# Altium project POEInjector.PrjPcb
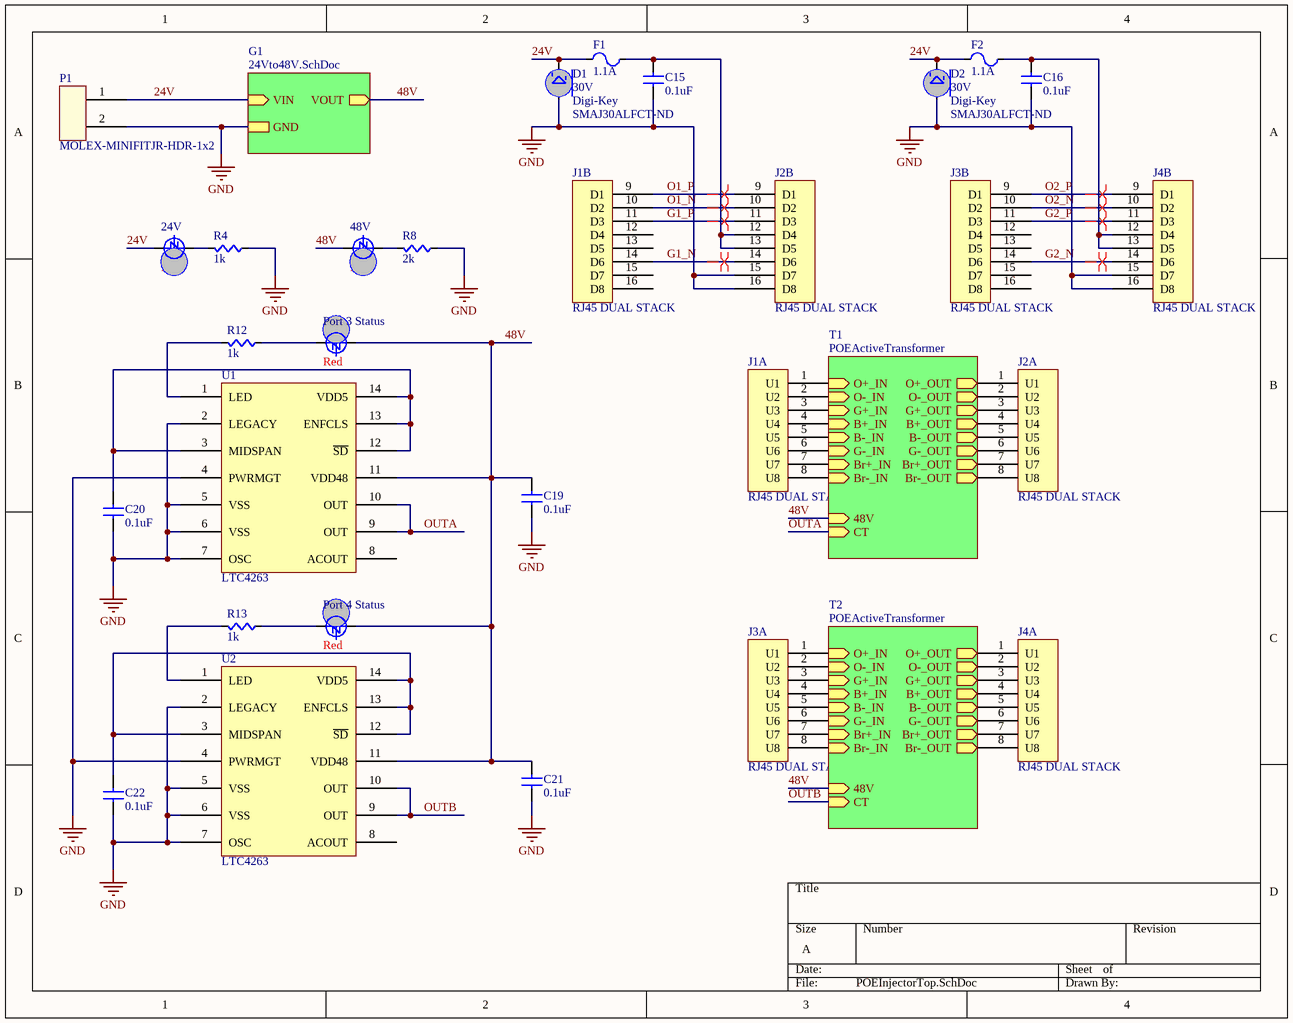
[diagram p0: POEInjectorTop.SchDoc]
3 sheets, 59 parts. Net scope: hierarchical (ports join the sheet entries above them; power ports are global).
Board file: POEInjector.PcbDoc
Sheets:
  POEInjectorTop.SchDoc
    G1 = 24Vto48V.SchDoc
    T1 = POEActiveTransformer.SchDoc
    T2 = POEActiveTransformer.SchDoc

## Sheet POEInjectorTop.SchDoc
size A

### Parts
24V  Color: Red  [LED0603]  (hidden comment: LED)
48V  Color: Red  [LED0603]  (hidden comment: LED)
C15  value 0.1uF  [CAPC0603]  (hidden comment: Cap)
C16  value 0.1uF  [CAPC0603]  (hidden comment: Cap)
C19  value 0.1uF  [CAPC0603]  (hidden comment: Cap)
C20  value 0.1uF  [CAPC0603]  (hidden comment: Cap)
C21  value 0.1uF  [CAPC0603]  (hidden comment: Cap)
C22  value 0.1uF  [CAPC0603]  (hidden comment: Cap)
D1  value 30V  Supplier 1: Digi-Key  Supplier Part Number 1: SMAJ30ALFCT-ND  [SMASeries]  (hidden comment: Zener)
D2  value 30V  Supplier 1: Digi-Key  Supplier Part Number 1: SMAJ30ALFCT-ND  [SMASeries]  (hidden comment: Zener)
F1  value 1.1A  [PTC7451X11N]  (hidden comment: PTC Fuse)
F2  value 1.1A  [PTC7451X11N]  (hidden comment: PTC Fuse)
J1  RJ45 DUAL STACK  [RJ45 DUAL STACK]  (parts A,B of 2)
J2  RJ45 DUAL STACK  [RJ45 DUAL STACK]  (parts A,B of 2)
J3  RJ45 DUAL STACK  [RJ45 DUAL STACK]  (parts A,B of 2)
J4  RJ45 DUAL STACK  [RJ45 DUAL STACK]  (parts A,B of 2)
P1  MOLEX-MINIFITJR-HDR-1x2  [MOLEX-MINIFITJR-HDR-1x2]
Port_3_Status  Color: Red  [LED0603]  (hidden comment: LED)
Port_4_Status  Color: Red  [LED0603]  (hidden comment: LED)
R4  value 1k  [RES0603]  (hidden comment: Res)
R8  value 2k  [RES0603]  (hidden comment: Res)
R12  value 1k  [RES0603]  (hidden comment: Res)
R13  value 1k  [RES0603]  (hidden comment: Res)
U1  LTC4263  [LTC4263]
U2  LTC4263  [LTC4263]

### Sub-sheets
G1 = 24Vto48V.SchDoc: VIN (in), GND, VOUT (out)
T1 = POEActiveTransformer: O+_IN, O-_IN, G+_IN, B+_IN, B-_IN, G-_IN, Br+_IN, Br-_IN, O+_OUT, O-_OUT, G+_OUT, B+_OUT, B-_OUT, G-_OUT, Br+_OUT, Br-_OUT, 48V, CT
T2 = POEActiveTransformer: O+_IN, O-_IN, G+_IN, B+_IN, B-_IN, G-_IN, Br+_IN, Br-_IN, O+_OUT, O-_OUT, G+_OUT, B+_OUT, B-_OUT, G-_OUT, Br+_OUT, Br-_OUT, 48V, CT

### Nets
GND: C15.2(B) C16.2(B) C19.2(B) C20.2(B) C21.2(B) C22.2(B) D1.A D2.A J2.15(D7) J2.16(D8) J4.15(D7) J4.16(D8) P1.2 R4.2(B) R8.2(B) U1.2(LEGACY) U1.4(PWRMGT) U1.5(VSS) U1.6(VSS) U1.7(OSC) U2.2(LEGACY) U2.4(PWRMGT) U2.5(VSS) U2.6(VSS) U2.7(OSC) ; sheet G1/GND
24V: 24V.A D1.C D2.C F1.1(A) F2.1(A) P1.1 ; sheet G1/VIN
48V: 48V.A C19.1(A) C21.1(A) Port_3_Status.A Port_4_Status.A U1.11(VDD48) U2.11(VDD48) ; sheet G1/VOUT, sheet T1/48V, sheet T2/48V
B_IN_N: J1.5(U5) ; sheet T1/B-_IN
B_IN_N: J3.5(U5) ; sheet T2/B-_IN  [a separate net that carries the same name]
B_IN_P: J1.4(U4) ; sheet T1/B+_IN
B_IN_P: J3.4(U4) ; sheet T2/B+_IN  [a separate net that carries the same name]
B_OUT_N: J2.5(U5) ; sheet T1/B-_OUT
B_OUT_N: J4.5(U5) ; sheet T2/B-_OUT  [a separate net that carries the same name]
B_OUT_P: J2.4(U4) ; sheet T1/B+_OUT
B_OUT_P: J4.4(U4) ; sheet T2/B+_OUT  [a separate net that carries the same name]
Br_IN_N: J1.8(U8) ; sheet T1/Br-_IN
Br_IN_N: J3.8(U8) ; sheet T2/Br-_IN  [a separate net that carries the same name]
Br_IN_P: J1.7(U7) ; sheet T1/Br+_IN
Br_IN_P: J3.7(U7) ; sheet T2/Br+_IN  [a separate net that carries the same name]
Br_OUT_N: J2.8(U8) ; sheet T1/Br-_OUT
Br_OUT_N: J4.8(U8) ; sheet T2/Br-_OUT  [a separate net that carries the same name]
Br_OUT_P: J2.7(U7) ; sheet T1/Br+_OUT
Br_OUT_P: J4.7(U7) ; sheet T2/Br+_OUT  [a separate net that carries the same name]
G1_N: J1.14(D6) J2.14(D6)
G1_P: J1.11(D3) J2.11(D3)
G2_N: J3.14(D6) J4.14(D6)
G2_P: J3.11(D3) J4.11(D3)
G_IN_N: J1.6(U6) ; sheet T1/G-_IN
G_IN_N: J3.6(U6) ; sheet T2/G-_IN  [a separate net that carries the same name]
G_IN_P: J1.3(U3) ; sheet T1/G+_IN
G_IN_P: J3.3(U3) ; sheet T2/G+_IN  [a separate net that carries the same name]
G_OUT_N: J2.6(U6) ; sheet T1/G-_OUT
G_OUT_N: J4.6(U6) ; sheet T2/G-_OUT  [a separate net that carries the same name]
G_OUT_P: J2.3(U3) ; sheet T1/G+_OUT
G_OUT_P: J4.3(U3) ; sheet T2/G+_OUT  [a separate net that carries the same name]
O1_N: J1.10(D2) J2.10(D2)
O1_P: J1.9(D1) J2.9(D1)
O2_N: J3.10(D2) J4.10(D2)
O2_P: J3.9(D1) J4.9(D1)
O_IN_N: J1.2(U2) ; sheet T1/O-_IN
O_IN_N: J3.2(U2) ; sheet T2/O-_IN  [a separate net that carries the same name]
O_IN_P: J1.1(U1) ; sheet T1/O+_IN
O_IN_P: J3.1(U1) ; sheet T2/O+_IN  [a separate net that carries the same name]
O_OUT_N: J2.2(U2) ; sheet T1/O-_OUT
O_OUT_N: J4.2(U2) ; sheet T2/O-_OUT  [a separate net that carries the same name]
O_OUT_P: J2.1(U1) ; sheet T1/O+_OUT
O_OUT_P: J4.1(U1) ; sheet T2/O+_OUT  [a separate net that carries the same name]
OUTA: U1.9(OUT) U1.10(OUT) ; sheet T1/CT
OUTB: U2.9(OUT) U2.10(OUT) ; sheet T2/CT  [project net OUTA]
Net24V_C: 24V.C R4.1(A)
Net48V_C: 48V.C R8.1(A)
NetC15_1: C15.1(A) F1.2(B) J2.12(D4) J2.13(D5)
NetC16_1: C16.1(A) F2.2(B) J4.12(D4) J4.13(D5)
NetC20_1: C20.1(A) U1.3(MIDSPAN) U1.12(~{SD}) U1.13(ENFCLS) U1.14(VDD5)
NetC22_1: C22.1(A) U2.3(MIDSPAN) U2.12(~{SD}) U2.13(ENFCLS) U2.14(VDD5)
NetPort_3_Status_C: Port_3_Status.C R12.2(B)
NetPort_4_Status_C: Port_4_Status.C R13.2(B)
NetR12_1: R12.1(A) U1.1(LED)
NetR13_1: R13.1(A) U2.1(LED)

Not connected (* = marked no-connect by the designer): J1 12(D4) 13(D5) 15(D7) 16(D8); J3 12(D4) 13(D5) 15(D7) 16(D8); U1 8(ACOUT); U2 8(ACOUT)

### Layout directives
differential pair: G1_N, G1_P, G2_N, G2_P, O1_N, O1_P, O2_N, O2_P

### Library data of the parts
D1 D2 = Zener: Zener Diode
F1 F2 = PTC_Fuse: Supplier 1: Digi-Key; Supplier Part Number 1: 507-1744-1-ND
J1-J4 = RJ45 DUAL STACK: CONN MOD JACK 8P8C R/A SHIELDED; Supplier 1: Digi-Key; Supplier Part Number 1: A31482-ND
P1 = MOLEX-MINIFITJR-HDR-1x2: MINIFITJRHDR VT DR O/PGS 2POS; Supplier 1: Digi-Key; Supplier Part Number 1: WM9814-ND
U1 U2 = LTC4263: IC POE 803.2AF SINGL PSE 14-SOIC; Supplier 1: Digi-Key; Supplier Part Number 1: LTC4263CS#PBF-ND
24V 48V Port_3_Status Port_4_Status = LED: Supplier 1: Digi-Key; Supplier Part Number 1: 754-1122-1-ND
C15 C16 C19-C22 = Cap: Supplier 1: Digi-Key
  C15 C16 C19 C21: Supplier Part Number 1: 1276-6807-1-ND
  C20 C22: Supplier Part Number 1: 1276-1000-1-ND
R4 R8 R12 R13 = Res: Supplier 1: Digi-Key
  R4 R12 R13: Supplier Part Number 1: RMCF0603JJ1K00CT-ND
  R8: Supplier Part Number 1: RMCF0603JT2K00CT-ND

## Sheet 24Vto48V.SchDoc
size A
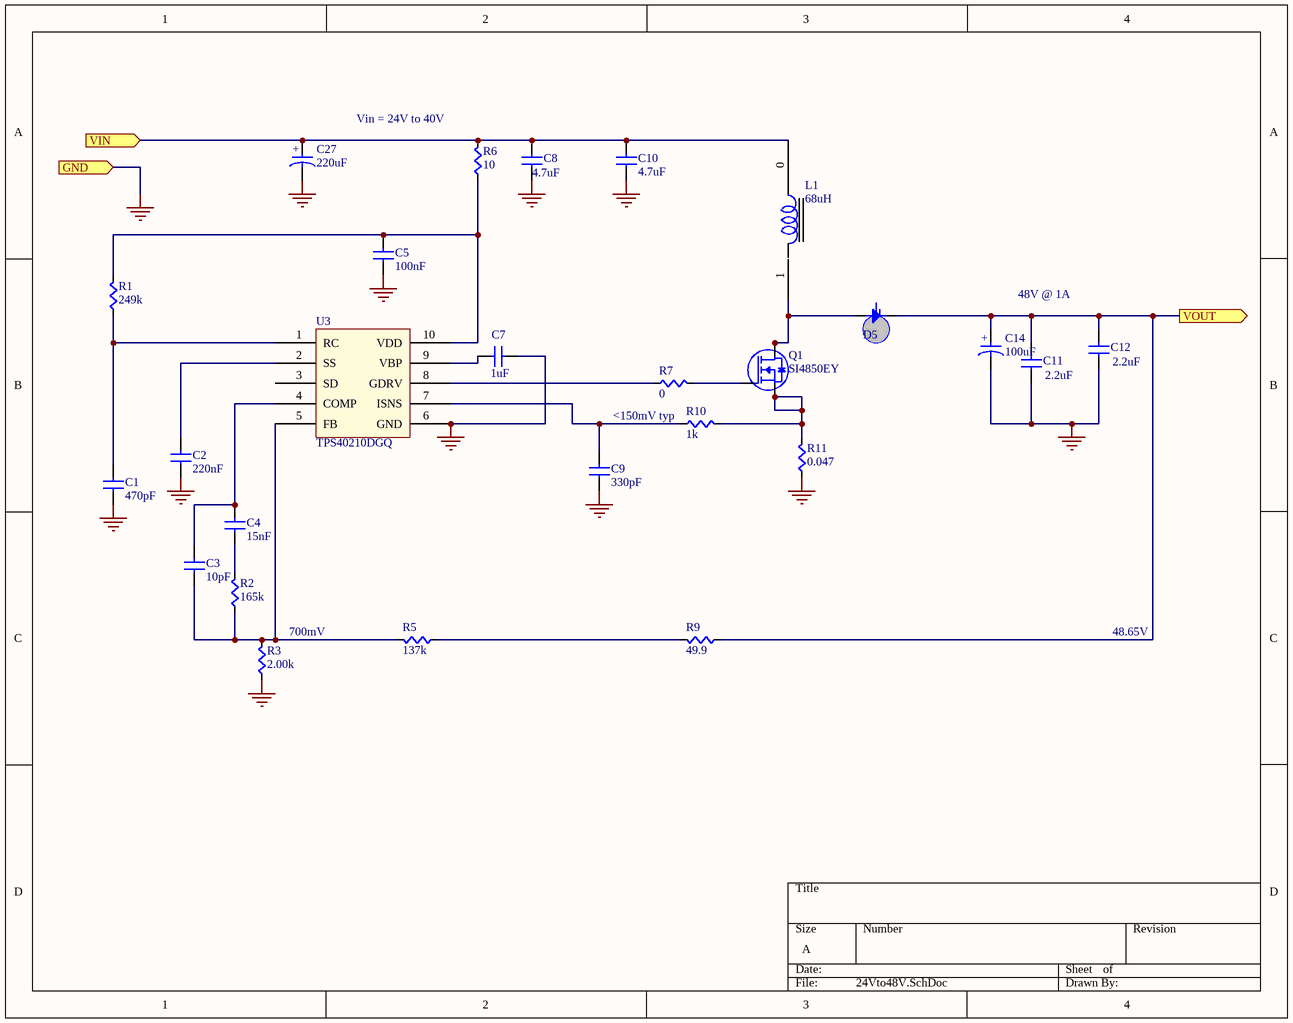
[diagram p1: 24Vto48V.SchDoc]

### Parts
C1  value 470pF  [CAPC0603]  (hidden comment: Cap)
C2  value 220nF  [CAPC0603]  (hidden comment: Cap)
C3  value 10pF  [CAPC0603]  (hidden comment: Cap)
C4  value 15nF  [CAPC0603]  (hidden comment: Cap)
C5  value 100nF  [CAPC0603]  (hidden comment: Cap)
C7  value 1uF  [CAPC0603]  (hidden comment: Cap)
C8  value 4.7uF  [CAP1210]  (hidden comment: CAP1210)
C9  value 330pF  [CAPC0603]  (hidden comment: Cap)
C10  value 4.7uF  [CAP1210]  (hidden comment: CAP1210)
C11  value 2.2uF  [CAP1210]  (hidden comment: CAP1210)
C12  value 2.2uF  [CAP1210]  (hidden comment: CAP1210)
C14  value 100uF  [565-1720-ND]  (hidden comment: Cap Tant)
C27  value 220uF  [ESY227M050AH2AA]  (hidden comment: Cap Tant)
D5  Diode  [MBRS360SMB]  (value not drawn)
L1  value 68uH  [732-1247-1-ND]  (hidden comment: 37392C)
Q1  SI4850EY  [SOIC-8-NO-EP]
R1  value 249k  [RES0603]  (hidden comment: Res)
R2  value 165k  [RES0603]  (hidden comment: Res)
R3  value 2.00k  [RES0603]  (hidden comment: Res)
R5  value 137k  [RES0603]  (hidden comment: Res)
R6  value 10  [RES0603]  (hidden comment: Res)
R7  value 0  [RES0603]  (hidden comment: Res)
R9  value 49.9  [RES0603]  (hidden comment: Res)
R10  value 1k  [RES0603]  (hidden comment: Res)
R11  value 0.047  [RES2512]  (hidden comment: Res)
U3  TPS40210DGQ  [TPS40210]

### Ports
GND (in), VIN (in), VOUT (out)

### Nets
GND: C1.2(B) C2.2(B) C5.2(B) C7.2(B) C8.2(B) C9.2(B) C10.2(B) C11.2(B) C12.2(B) C14.2(B) C27.2(B) R3.2(B) R11.2(B) U3.6(GND) ; port GND
24V: C8.1(A) C10.1(A) C27.1(A) L1.0 R6.1(A) ; port VIN
48V: C11.1(A) C12.1(A) C14.1(A) D5.C R9.2(B) ; port VOUT
NetC1_1: C1.1(A) R1.2(B) U3.1(RC)
NetC2_1: C2.1(A) U3.2(SS)
NetC3_1: C3.1(A) C4.1(A) U3.4(COMP)
NetC3_2: C3.2(B) R2.2(B) R3.1(A) R5.1(A) U3.5(FB)
NetC4_2: C4.2(B) R2.1(A)
NetC5_1: C5.1(A) R1.1(A) R6.2(B) U3.10(VDD)
NetC7_1: C7.1(A) U3.9(VBP)
NetC9_1: C9.1(A) R10.2(B) U3.7(ISNS)
NetD5_A: D5.A L1.1 Q1.5(D) Q1.6(D) Q1.7(D) Q1.8(D)
NetQ1_1: Q1.1(S) Q1.2(S) Q1.3(S) R10.1(A) R11.1(A)
NetQ1_4: Q1.4(G) R7.1(A)
NetR5_2: R5.2(B) R9.1(A)
NetR7_2: R7.2(B) U3.8(GDRV)

Not connected (* = marked no-connect by the designer): U3 3(SD)

### Notes on the sheet
- (near R6) Vin = 24V to 40V
- 48V @ 1A
- (near R10) <150mV typ
- (near R3) 700mV
- 48.65V
- (in symbol CapPol) +

### Library data of the parts
C8 C10-C12 = CAP1210: CAP CER 10UF 50V 20% X5R 1210; Supplier 1: Digi-Key
  C8 C10: Supplier Part Number 1: 1276-1292-1-ND
  C11 C12: Supplier Part Number 1: 445-4498-1-ND
C14 = CapPol: 100 uF CAP ALUM 20% 63V RADIAL; Supplier 1: Digi-Key; Supplier Part Number 1: 493-12928-1-ND
C27 = CapPol: CAP ALUM 220UF; Supplier 1: Digi-Key; Supplier Part Number 1: 399-6123-ND
D5 = Diode: Standard Diode Template; Value: 60V 3A; Supplier Part Number 1: MBRS360BT3GOSCT-ND; Supplier: Digi-Key
L1 = 37392C: INDUCTOR 3.90UH 10.0A SMD; Supplier 1: Digi-Key; Supplier Part Number 1: 732-1247-1-ND
Q1 = SI4850EY: MOSFET N-CH 60V 6A 8-SOIC; Supplier 1: Digi-Key; Supplier Part Number 1: SI4850EY-T1-E3CT-ND
C1-C5 C7 C9 = Cap: Supplier 1: Digi-Key
  C1: Supplier Part Number 1: 399-7919-1-ND
  C2: Supplier Part Number 1: 445-1318-1-ND
  C3: Supplier Part Number 1: 490-3570-1-ND
  C4: Supplier Part Number 1: 1276-1967-1-ND
  C5: Supplier Part Number 1: 311-1343-1-ND
  C7: Supplier Part Number 1: 311-1446-1-ND
  C9: Supplier Part Number 1: 1276-6658-1-ND
R1-R3 R5-R7 R9-R11 = Res: Supplier 1: Digi-Key
  R1: Supplier Part Number 1: A102243CT-ND
  R2: Supplier Part Number 1: 311-165KHRCT-ND
  R3: Supplier Part Number 1: 311-2.00KHRCT-ND
  R5: Supplier Part Number 1: 311-137KHRCT-ND
  R6: Supplier Part Number 1: 311-10.0HRCT-ND
  R7: Supplier Part Number 1: 311-0.0GRCT-ND
  R9: Supplier Part Number 1: A102283CT-ND
  R10: Supplier Part Number 1: A102226CT-ND
  R11: Supplier Part Number 1: P47TCT-ND
U3 = TPS40210DGQ: Supplier Part Number 1: 296-26969-1-ND; Supplier 1: Digi-Key

## Sheet POEActiveTransformer.SchDoc
size A
Used 2 times, as channels T1, T2. Parts and nets are listed once, with the designators drawn on the sheet.
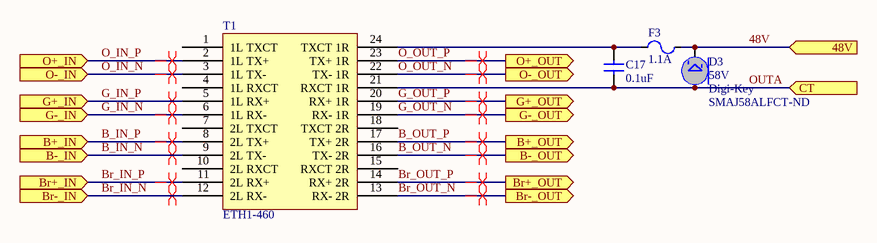
[diagram p2: POEActiveTransformer.SchDoc]

### Parts
C17  value 0.1uF  [CAPC0603]  (hidden comment: Cap)
D3  value 58V  Supplier 1: Digi-Key  Supplier Part Number 1: SMAJ58ALFCT-ND  [SMASeries]  (hidden comment: Zener)
F3  value 1.1A  [PTC7451X11N]  (hidden comment: PTC Fuse)
T1  ETH1-460  [ETH1-460]

### Ports
48V (in), B+_IN (in), B+_OUT (out), B-_IN (in), B-_OUT (out), Br+_IN (in), Br+_OUT (out), Br-_IN (in), Br-_OUT (out), CT (in), G+_IN (in), G+_OUT (out), G-_IN (in), G-_OUT (out), O+_IN (in), O+_OUT (out), O-_IN (in), O-_OUT (out)

### Nets
48V: D3.C F3.2(B) ; port 48V
B_IN_N: T1.9(2L_TX-) ; port B-_IN
B_IN_P: T1.8(2L_TX+) ; port B+_IN
B_OUT_N: T1.16(TX-_2R) ; port B-_OUT
B_OUT_P: T1.17(TX+_2R) ; port B+_OUT
Br_IN_N: T1.12(2L_RX-) ; port Br-_IN
Br_IN_P: T1.11(2L_RX+) ; port Br+_IN
Br_OUT_N: T1.13(RX-_2R) ; port Br-_OUT
Br_OUT_P: T1.14(RX+_2R) ; port Br+_OUT
G_IN_N: T1.6(1L_RX-) ; port G-_IN
G_IN_P: T1.5(1L_RX+) ; port G+_IN
G_OUT_N: T1.19(RX-_1R) ; port G-_OUT
G_OUT_P: T1.20(RX+_1R) ; port G+_OUT
O_IN_N: T1.3(1L_TX-) ; port O-_IN
O_IN_P: T1.2(1L_TX+) ; port O+_IN
O_OUT_N: T1.22(TX-_1R) ; port O-_OUT
O_OUT_P: T1.23(TX+_1R) ; port O+_OUT
OUTA: C17.2(B) D3.A T1.21(RXCT_1R) ; port CT
NetC17_1: C17.1(A) F3.1(A) T1.24(TXCT_1R)

Not connected (* = marked no-connect by the designer): T1 1(1L_TXCT) 4(1L_RXCT) 7(2L_TXCT) 10(2L_RXCT) 15(RXCT_2R) 18(TXCT_2R)

### Channels
T1: designators end in _T1; ports 48V=48V B+_IN=B_IN_P B+_OUT=B_OUT_P B-_IN=B_IN_N B-_OUT=B_OUT_N Br+_IN=Br_IN_P Br+_OUT=Br_OUT_P Br-_IN=Br_IN_N Br-_OUT=Br_OUT_N CT=OUTA G+_IN=G_IN_P G+_OUT=G_OUT_P G-_IN=G_IN_N G-_OUT=G_OUT_N O+_IN=O_IN_P O+_OUT=O_OUT_P O-_IN=O_IN_N O-_OUT=O_OUT_N
T2: designators end in _T2; ports 48V=48V B+_IN=B_IN_P B+_OUT=B_OUT_P B-_IN=B_IN_N B-_OUT=B_OUT_N Br+_IN=Br_IN_P Br+_OUT=Br_OUT_P Br-_IN=Br_IN_N Br-_OUT=Br_OUT_N CT=OUTA G+_IN=G_IN_P G+_OUT=G_OUT_P G-_IN=G_IN_N G-_OUT=G_OUT_N O+_IN=O_IN_P O+_OUT=O_OUT_P O-_IN=O_IN_N O-_OUT=O_OUT_N

### Layout directives
differential pair: B_IN_N, B_IN_P, B_OUT_N, B_OUT_P, Br_IN_N, Br_IN_P, Br_OUT_N, Br_OUT_P, G_IN_N, G_IN_P, G_OUT_N, G_OUT_P, O_IN_N, O_IN_P, O_OUT_N, O_OUT_P

### Library data of the parts
D3 = Zener: Zener Diode
F3 = PTC_Fuse: Supplier 1: Digi-Key; Supplier Part Number 1: 507-1744-1-ND
T1 = ETH1-460: "PoE Plus" Transformers Audio & Signal ETH1 60W 4pairs PoE+ Magnetic Module; Supplier 1: *; Supplier Part Number 1: *
C17 = Cap: Supplier 1: Digi-Key; Supplier Part Number 1: 1276-6807-1-ND

## Nets that join several sheets
GND: POEInjectorTop (25 pins), 24Vto48V (14 pins)
24V: POEInjectorTop (6 pins), 24Vto48V (5 pins)
48V: POEInjectorTop (7 pins), 24Vto48V (5 pins), T1 (D3_T1.C F3_T1.2), T2 (D3_T2.C F3_T2.2)
B_IN_N: POEInjectorTop (J1.5), T1 (T1_T1.9)
B_IN_N: POEInjectorTop (J3.5), T2 (T1_T2.9)
B_IN_P: POEInjectorTop (J1.4), T1 (T1_T1.8)
B_IN_P: POEInjectorTop (J3.4), T2 (T1_T2.8)
B_OUT_N: POEInjectorTop (J2.5), T1 (T1_T1.16)
B_OUT_N: POEInjectorTop (J4.5), T2 (T1_T2.16)
B_OUT_P: POEInjectorTop (J2.4), T1 (T1_T1.17)
B_OUT_P: POEInjectorTop (J4.4), T2 (T1_T2.17)
Br_IN_N: POEInjectorTop (J1.8), T1 (T1_T1.12)
Br_IN_N: POEInjectorTop (J3.8), T2 (T1_T2.12)
Br_IN_P: POEInjectorTop (J1.7), T1 (T1_T1.11)
Br_IN_P: POEInjectorTop (J3.7), T2 (T1_T2.11)
Br_OUT_N: POEInjectorTop (J2.8), T1 (T1_T1.13)
Br_OUT_N: POEInjectorTop (J4.8), T2 (T1_T2.13)
Br_OUT_P: POEInjectorTop (J2.7), T1 (T1_T1.14)
Br_OUT_P: POEInjectorTop (J4.7), T2 (T1_T2.14)
G_IN_N: POEInjectorTop (J1.6), T1 (T1_T1.6)
G_IN_N: POEInjectorTop (J3.6), T2 (T1_T2.6)
G_IN_P: POEInjectorTop (J1.3), T1 (T1_T1.5)
G_IN_P: POEInjectorTop (J3.3), T2 (T1_T2.5)
G_OUT_N: POEInjectorTop (J2.6), T1 (T1_T1.19)
G_OUT_N: POEInjectorTop (J4.6), T2 (T1_T2.19)
G_OUT_P: POEInjectorTop (J2.3), T1 (T1_T1.20)
G_OUT_P: POEInjectorTop (J4.3), T2 (T1_T2.20)
O_IN_N: POEInjectorTop (J1.2), T1 (T1_T1.3)
O_IN_N: POEInjectorTop (J3.2), T2 (T1_T2.3)
O_IN_P: POEInjectorTop (J1.1), T1 (T1_T1.2)
O_IN_P: POEInjectorTop (J3.1), T2 (T1_T2.2)
O_OUT_N: POEInjectorTop (J2.2), T1 (T1_T1.22)
O_OUT_N: POEInjectorTop (J4.2), T2 (T1_T2.22)
O_OUT_P: POEInjectorTop (J2.1), T1 (T1_T1.23)
O_OUT_P: POEInjectorTop (J4.1), T2 (T1_T2.23)
OUTA: POEInjectorTop (U1.9 U1.10), T1 (C17_T1.2 D3_T1.A T1_T1.21)
OUTA: POEInjectorTop (U2.9 U2.10), T2 (C17_T2.2 D3_T2.A T1_T2.21)